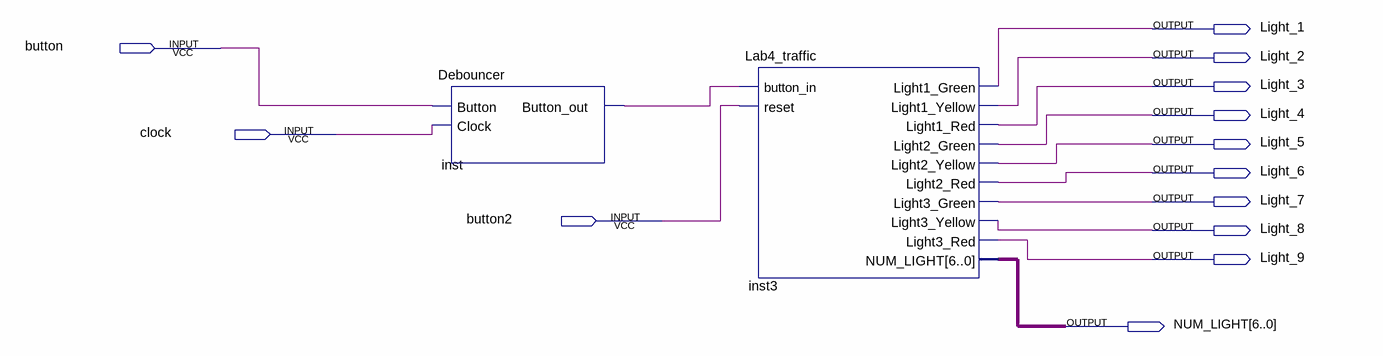
[diagram p0: schematic sheet]
// Quartus schematic traffic_light_top_level.bdf as structural Verilog: 2 symbols, 13 pins
module traffic_light_top_level (
  input  button,
  input  clock,
  input  button2,
  output Light_1,
  output Light_2,
  output Light_3,
  output Light_4,
  output Light_5,
  output Light_6,
  output Light_7,
  output Light_8,
  output Light_9,
  output [6:0] NUM_LIGHT
);

  wire inst_button_out;

  Debouncer inst (.Button(button), .Clock(clock), .Button_out(inst_button_out));
  Lab4_traffic inst3 (
    .button_in(inst_button_out), .reset(button2), .Light1_Green(Light_1), .Light1_Yellow(Light_2),
    .Light1_Red(Light_3), .Light2_Green(Light_4), .Light2_Yellow(Light_5), .Light2_Red(Light_6),
    .Light3_Green(Light_7), .Light3_Yellow(Light_8), .Light3_Red(Light_9), .NUM_LIGHT(NUM_LIGHT));
endmodule
